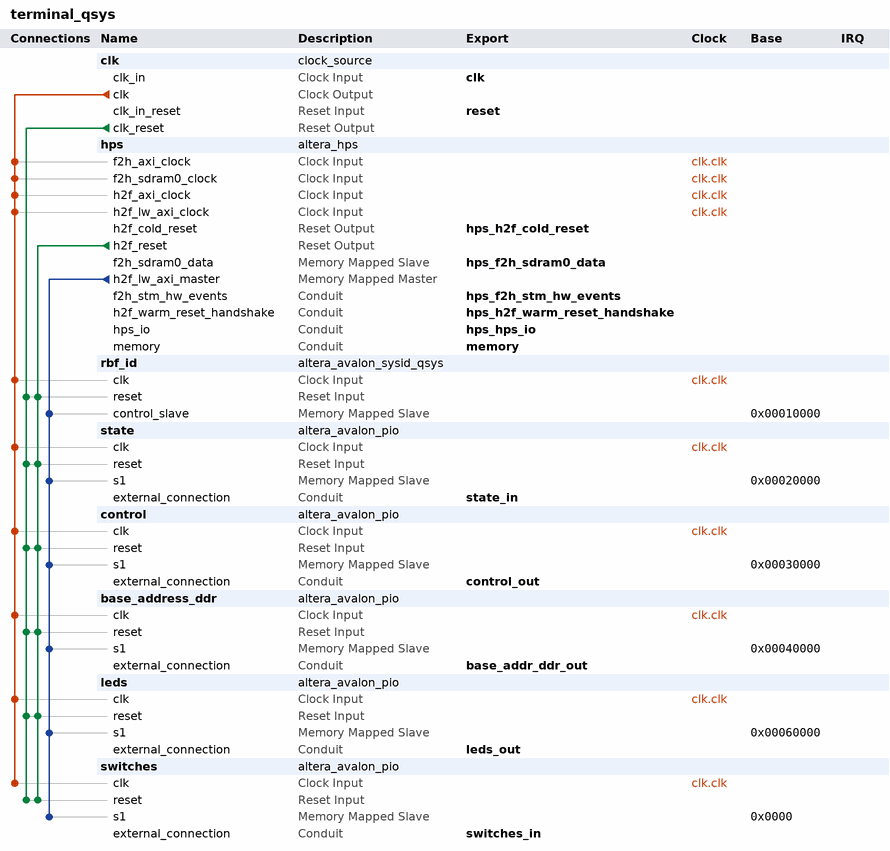
[diagram p0: system contents]
# Platform Designer (Qsys) system terminal_qsys, Cyclone V 5CSEMA5F31C6
# Parameters at their usual value, and those the tool derives, are not listed.
package require -exact qsys 16.1
create_system terminal_qsys
set_project_property DEVICE_FAMILY {Cyclone V}
set_project_property DEVICE 5CSEMA5F31C6

add_instance clk clock_source 16.1
set_instance_parameter_value clk clockFrequency 50000000

add_instance hps altera_hps 16.1
set_instance_parameter_value hps EMAC1_Mode RGMII
set_instance_parameter_value hps EMAC1_PinMuxing {HPS I/O Set 0}
set_instance_parameter_value hps F2SCLK_COLDRST_Enable false
set_instance_parameter_value hps F2SCLK_DBGRST_Enable false
set_instance_parameter_value hps F2SCLK_WARMRST_Enable false
set_instance_parameter_value hps F2SDRAM_Type {Avalon-MM Bidirectional}
set_instance_parameter_value hps F2SDRAM_Width 256
set_instance_parameter_value hps F2SINTERRUPT_Enable false
set_instance_parameter_value hps F2S_Width 1
set_instance_parameter_value hps FPGA_PERIPHERAL_OUTPUT_CLOCK_FREQ_EMAC0_GTX_CLK 125
set_instance_parameter_value hps FPGA_PERIPHERAL_OUTPUT_CLOCK_FREQ_EMAC0_MD_CLK 2.5
set_instance_parameter_value hps FPGA_PERIPHERAL_OUTPUT_CLOCK_FREQ_EMAC1_GTX_CLK 125
set_instance_parameter_value hps FPGA_PERIPHERAL_OUTPUT_CLOCK_FREQ_EMAC1_MD_CLK 2.5
set_instance_parameter_value hps HPS_PROTOCOL DDR3
set_instance_parameter_value hps I2C0_Mode N/A
set_instance_parameter_value hps I2C0_PinMuxing Unused
set_instance_parameter_value hps I2C1_Mode N/A
set_instance_parameter_value hps I2C1_PinMuxing Unused
set_instance_parameter_value hps LWH2F_Enable true
set_instance_parameter_value hps MEM_BANKADDR_WIDTH 3
set_instance_parameter_value hps MEM_CLK_FREQ 400.0
set_instance_parameter_value hps MEM_COL_ADDR_WIDTH 10
set_instance_parameter_value hps MEM_DQ_WIDTH 32
set_instance_parameter_value hps MEM_DRV_STR RZQ/6
set_instance_parameter_value hps MEM_ROW_ADDR_WIDTH 15
set_instance_parameter_value hps MEM_RTT_NOM RZQ/6
set_instance_parameter_value hps MEM_RTT_WR {Dynamic ODT off}
set_instance_parameter_value hps MEM_TCL 7
set_instance_parameter_value hps MEM_TFAW_NS 45.0
set_instance_parameter_value hps MEM_TRAS_NS 36.0
set_instance_parameter_value hps MEM_TRCD_NS 13.125
set_instance_parameter_value hps MEM_TRFC_NS 300.0
set_instance_parameter_value hps MEM_TRP_NS 13.125
set_instance_parameter_value hps MEM_VENDOR Micron
set_instance_parameter_value hps MEM_WTCL 7
set_instance_parameter_value hps QSPI_Mode N/A
set_instance_parameter_value hps QSPI_PinMuxing Unused
set_instance_parameter_value hps REF_CLK_FREQ 25.0
set_instance_parameter_value hps S2FCLK_COLDRST_Enable true
set_instance_parameter_value hps S2FCLK_PENDINGRST_Enable true
set_instance_parameter_value hps S2FCLK_USER2CLK 5
set_instance_parameter_value hps S2F_Width 1
set_instance_parameter_value hps SDIO_Mode {4-bit Data}
set_instance_parameter_value hps SDIO_PinMuxing {HPS I/O Set 0}
set_instance_parameter_value hps SPIM1_Mode N/A
set_instance_parameter_value hps SPIM1_PinMuxing Unused
set_instance_parameter_value hps STM_Enable true
set_instance_parameter_value hps TIMING_BOARD_AC_SKEW 0.02
set_instance_parameter_value hps TIMING_BOARD_AC_TO_CK_SKEW 0.01
set_instance_parameter_value hps TIMING_BOARD_DQ_TO_DQS_SKEW 0.05
set_instance_parameter_value hps TIMING_BOARD_MAX_CK_DELAY 0.03
set_instance_parameter_value hps TIMING_BOARD_MAX_DQS_DELAY 0.02
set_instance_parameter_value hps TIMING_BOARD_SKEW_BETWEEN_DQS 0.06
set_instance_parameter_value hps TIMING_BOARD_SKEW_CKDQS_DIMM_MAX 0.12
set_instance_parameter_value hps TIMING_BOARD_SKEW_CKDQS_DIMM_MIN 0.06
set_instance_parameter_value hps TIMING_BOARD_SKEW_WITHIN_DQS 0.01
set_instance_parameter_value hps TIMING_TDH 65
set_instance_parameter_value hps TIMING_TDQSCK 255
set_instance_parameter_value hps TIMING_TDQSQ 125
set_instance_parameter_value hps TIMING_TDS 30
set_instance_parameter_value hps TIMING_TIH 140
set_instance_parameter_value hps TIMING_TIS 190
set_instance_parameter_value hps TIMING_TQSH 0.4
set_instance_parameter_value hps UART0_Mode {No Flow Control}
set_instance_parameter_value hps UART0_PinMuxing {HPS I/O Set 0}
set_instance_parameter_value hps USB1_Mode N/A
set_instance_parameter_value hps USB1_PinMuxing Unused
set_instance_parameter_value hps desired_cfg_clk_mhz 100.0
set_instance_parameter_value hps desired_qspi_clk_mhz 400.0
set_instance_parameter_value hps use_default_mpu_clk false

add_instance rbf_id altera_avalon_sysid_qsys 16.1
set_instance_parameter_value rbf_id id 1152

add_instance state altera_avalon_pio 16.1
set_instance_parameter_value state direction Input
set_instance_parameter_value state simDoTestBenchWiring true
set_instance_parameter_value state width 32

add_instance control altera_avalon_pio 16.1
set_instance_parameter_value control direction Output
set_instance_parameter_value control width 32

add_instance base_address_ddr altera_avalon_pio 16.1
set_instance_parameter_value base_address_ddr direction Output
set_instance_parameter_value base_address_ddr width 32

add_instance leds altera_avalon_pio 16.1
set_instance_parameter_value leds direction Output
set_instance_parameter_value leds width 10

add_instance switches altera_avalon_pio 16.1
set_instance_parameter_value switches direction Input
set_instance_parameter_value switches simDoTestBenchWiring true
set_instance_parameter_value switches width 10

# connections
add_connection clk.clk base_address_ddr.clk clock
add_connection clk.clk control.clk clock
add_connection clk.clk hps.f2h_axi_clock clock
add_connection clk.clk hps.f2h_sdram0_clock clock
add_connection clk.clk hps.h2f_axi_clock clock
add_connection clk.clk hps.h2f_lw_axi_clock clock
add_connection clk.clk leds.clk clock
add_connection clk.clk rbf_id.clk clock
add_connection clk.clk state.clk clock
add_connection clk.clk switches.clk clock
add_connection clk.clk_reset base_address_ddr.reset reset
add_connection clk.clk_reset control.reset reset
add_connection clk.clk_reset leds.reset reset
add_connection clk.clk_reset rbf_id.reset reset
add_connection clk.clk_reset state.reset reset
add_connection clk.clk_reset switches.reset reset
add_connection hps.h2f_reset base_address_ddr.reset reset
add_connection hps.h2f_reset control.reset reset
add_connection hps.h2f_reset leds.reset reset
add_connection hps.h2f_reset rbf_id.reset reset
add_connection hps.h2f_reset state.reset reset
add_connection hps.h2f_reset switches.reset reset
add_connection hps.h2f_lw_axi_master base_address_ddr.s1 avalon
set_connection_parameter_value hps.h2f_lw_axi_master/base_address_ddr.s1 baseAddress 0x00040000
add_connection hps.h2f_lw_axi_master control.s1 avalon
set_connection_parameter_value hps.h2f_lw_axi_master/control.s1 baseAddress 0x00030000
add_connection hps.h2f_lw_axi_master leds.s1 avalon
set_connection_parameter_value hps.h2f_lw_axi_master/leds.s1 baseAddress 0x00060000
add_connection hps.h2f_lw_axi_master rbf_id.control_slave avalon
set_connection_parameter_value hps.h2f_lw_axi_master/rbf_id.control_slave baseAddress 0x00010000
add_connection hps.h2f_lw_axi_master state.s1 avalon
set_connection_parameter_value hps.h2f_lw_axi_master/state.s1 baseAddress 0x00020000
add_connection hps.h2f_lw_axi_master switches.s1 avalon
set_connection_parameter_value hps.h2f_lw_axi_master/switches.s1 baseAddress 0x0000

# exported interfaces
add_interface base_addr_ddr_out conduit end
set_interface_property base_addr_ddr_out EXPORT_OF base_address_ddr.external_connection
add_interface clk clock sink
set_interface_property clk EXPORT_OF clk.clk_in
add_interface control_out conduit end
set_interface_property control_out EXPORT_OF control.external_connection
add_interface hps_f2h_sdram0_data avalon slave
set_interface_property hps_f2h_sdram0_data EXPORT_OF hps.f2h_sdram0_data
add_interface hps_f2h_stm_hw_events conduit end
set_interface_property hps_f2h_stm_hw_events EXPORT_OF hps.f2h_stm_hw_events
add_interface hps_h2f_cold_reset reset source
set_interface_property hps_h2f_cold_reset EXPORT_OF hps.h2f_cold_reset
add_interface hps_h2f_warm_reset_handshake conduit end
set_interface_property hps_h2f_warm_reset_handshake EXPORT_OF hps.h2f_warm_reset_handshake
add_interface hps_hps_io conduit end
set_interface_property hps_hps_io EXPORT_OF hps.hps_io
add_interface leds_out conduit end
set_interface_property leds_out EXPORT_OF leds.external_connection
add_interface memory conduit end
set_interface_property memory EXPORT_OF hps.memory
add_interface reset reset sink
set_interface_property reset EXPORT_OF clk.clk_in_reset
add_interface state_in conduit end
set_interface_property state_in EXPORT_OF state.external_connection
add_interface switches_in conduit end
set_interface_property switches_in EXPORT_OF switches.external_connection

set_interconnect_requirement {$system} qsys_mm.clockCrossingAdapter HANDSHAKE
set_interconnect_requirement {$system} qsys_mm.enableEccProtection FALSE
set_interconnect_requirement {$system} qsys_mm.insertDefaultSlave FALSE
set_interconnect_requirement {$system} qsys_mm.maxAdditionalLatency 1

save_system terminal_qsys.qsys
